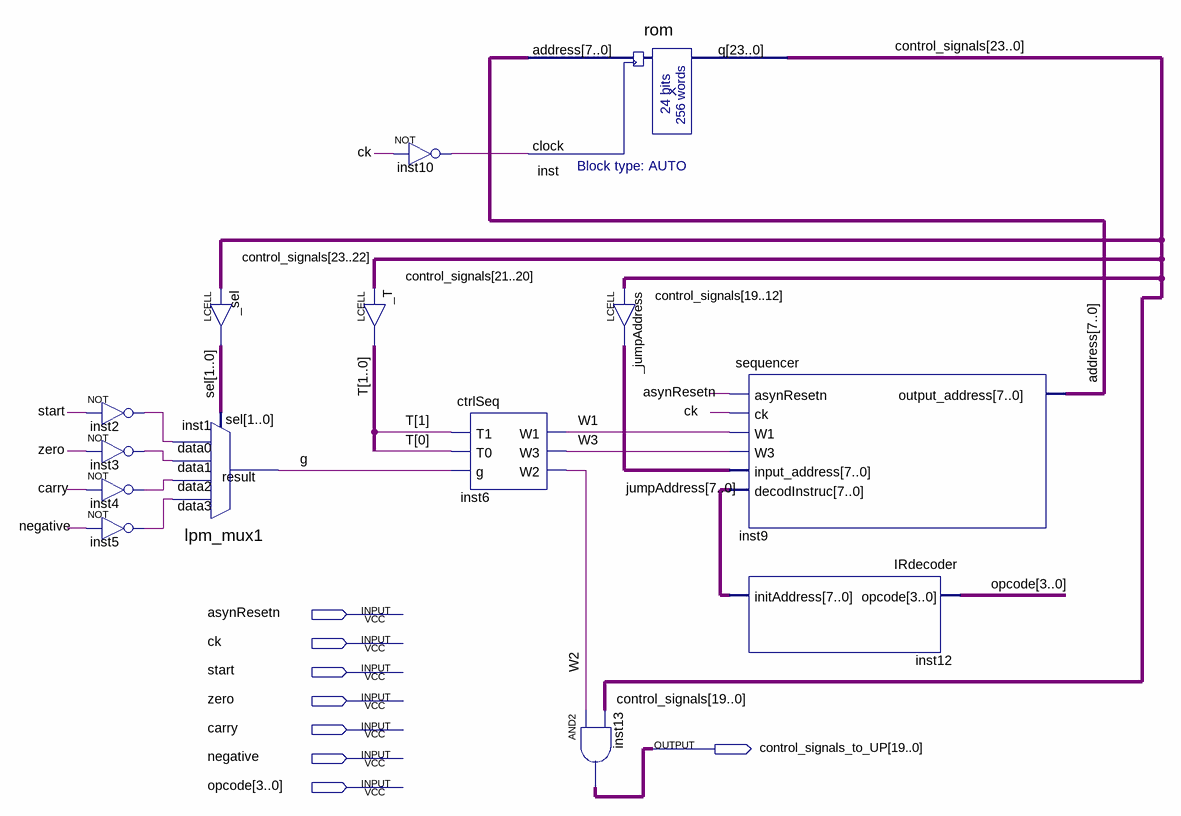
[diagram p0: schematic sheet]
// Quartus schematic UC.bdf as structural Verilog: 14 symbols, 8 pins
module UC (
  input  asynResetn,
  input  ck,
  input  start,
  input  zero,
  input  carry,
  input  negative,
  input  [3:0] opcode,
  output [19:0] control_signals_to_UP
);

  wire g, inst2_out, inst3_out, inst4_out, inst5_out, inst10_out, W1, W2, W3;
  wire [1:0] sel, T;
  wire [7:0] address, inst12_initaddress, jumpAddress;
  wire [23:0] control_signals;

  not inst2 (inst2_out, start);
  not inst3 (inst3_out, zero);
  not inst4 (inst4_out, carry);
  not inst5 (inst5_out, negative);
  LCELL _sel[1:0] (.IN(control_signals[23:22]), .OUT(sel));
  lpm_mux1 inst1 (.data3(inst5_out), .data2(inst4_out), .data1(inst3_out), .data0(inst2_out), .sel(sel), .result(g));
  LCELL _T[1:0] (.IN(control_signals[21:20]), .OUT(T));
  not inst10 (inst10_out, ck);
  ctrlSeq inst6 (.T1(T[1]), .T0(T[0]), .g(g), .W1(W1), .W3(W3), .W2(W2));
  rom inst (.address(address), .clock(inst10_out), .q(control_signals));
  assign control_signals_to_UP = {20{W2}} & control_signals[19:0];  // AND2 inst13, 20 bits wide
  LCELL _jumpAddress[7:0] (.IN(control_signals[19:12]), .OUT(jumpAddress));
  sequencer inst9 (
    .asynResetn(asynResetn), .ck(ck), .W1(W1), .W3(W3), .input_address(jumpAddress),
    .decodInstruc(inst12_initaddress), .output_address(address));
  IRdecoder inst12 (.opcode(opcode), .initAddress(inst12_initaddress));
endmodule
